# EAGLE design Orgel-form3 (EAGLE 5.11)
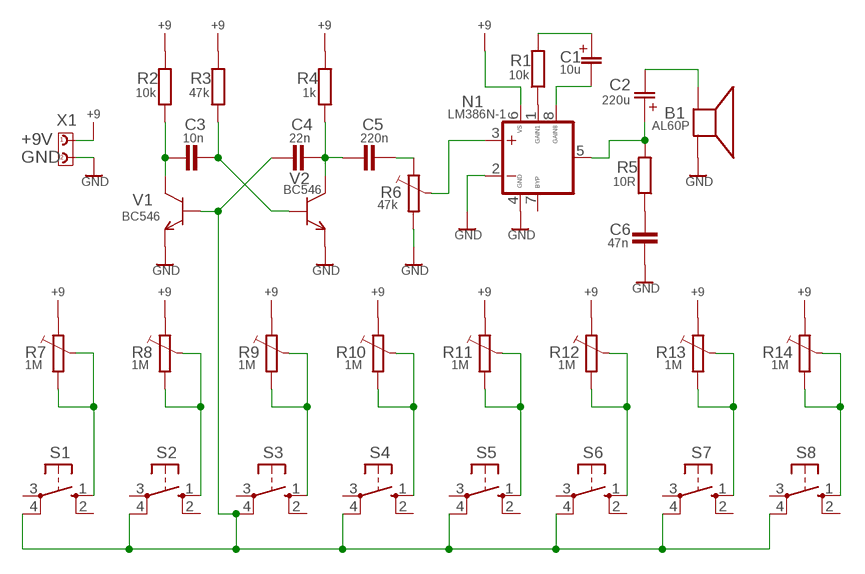
[diagram p0: schematic, sheet 1]

## Parts
B1  AL60P  [AL60P]
C1  10u  CPOL-EUE2-5  [E2-5]
C2  220u  CPOL-EUE2.5-7  [E2,5-7]
C3  10n  C-EUC05-024X044  [C050-024X044]
C4  22n  C-EUC05-024X044  [C050-024X044]
C5  220n  C-EUC05-024X044  [C050-024X044]
C6  47n  C-EUC05-024X044  [C050-024X044]
N1  LM386N-1  [DIL08]
R1  10k  R-EU_0207/10  [0207/10]
R2  10k  R-EU_0207/10  [0207/10]
R3  47k  R-EU_0207/10  [0207/10]
R4  1k  R-EU_0207/10  [0207/10]
R5  10R  R-EU_0207/10  [0207/10]
R6  47k  PT6LIEG  [PT-6]
R7  1M  PT6LIEG  [PT-6]
R8  1M  PT6LIEG  [PT-6]
R9  1M  PT6LIEG  [PT-6]
R10  1M  PT6LIEG  [PT-6]
R11  1M  PT6LIEG  [PT-6]
R12  1M  PT6LIEG  [PT-6]
R13  1M  PT6LIEG  [PT-6]
R14  1M  PT6LIEG  [PT-6]
S1  TASTE10-XX  [B3F-10XX]
S2  TASTE10-XX  [B3F-10XX]
S3  TASTE10-XX  [B3F-10XX]
S4  TASTE10-XX  [B3F-10XX]
S5  TASTE10-XX  [B3F-10XX]
S6  TASTE10-XX  [B3F-10XX]
S7  TASTE10-XX  [B3F-10XX]
S8  TASTE10-XX  [B3F-10XX]
V1  BC546  NPN_EBCBC546  [TO92IL]
V2  BC546  NPN_EBCBC546  [TO92IL]
X1  AK500/2  [AK500/2]

## Nets
+9 [+9]: N1.6(VS) R2.2 R3.2 R4.2 R7.E R8.E R9.E R10.E R11.E R12.E R13.E R14.E X1.1
GND [gnd]: B1.2 C6.2 N1.2(-IN) N1.4(GND) R6.A V1.E V2.E X1.2
N$1: C4.1 S1.4(P1) S2.4(P1) S3.4(P1) S4.4(P1) S5.4(P1) S6.4(P1) S7.4(P1) S8.4(P1) V1.B
N$2: C3.2 R3.1 V2.B
N$3: C4.2 C5.1 R4.1 V2.C
N$4: C3.1 R2.1 V1.C
N$6: R8.A R8.S S2.1(S)
N$7: R7.A R7.S S1.1(S)
N$8: R9.A R9.S S3.1(S)
N$9: R10.A R10.S S4.1(S)
N$10: R11.A R11.S S5.1(S)
N$11: R12.A R12.S S6.1(S)
N$12: R13.A R13.S S7.1(S)
N$13: R14.A R14.S S8.1(S)
N$14: N1.1(GAIN) R1.1
N$16: N1.3(+IN) R6.S
N$17: C5.2 R6.E
N$18: C1.+ R1.2
N$19: C1.- N1.8(GAIN)
N$20: B1.1 C2.-
N$21: C2.+ N1.5(OUT) R5.2
N$22: C6.1 R5.1
Unconnected: N1.7(BYPASS) S1.2(S1) S1.3(P) S2.2(S1) S2.3(P) S3.2(S1) S3.3(P) S4.2(S1) S4.3(P) S5.2(S1) S5.3(P) S6.2(S1) S6.3(P) S7.2(S1) S7.3(P) S8.2(S1) S8.3(P)

## Notes on the sheet
- +9V
- GND

## Library data of the parts
B1 = mylib:AL60P: SPEAKER Source: Buerklin
C1 C2 = mylib:CPOL-EU: POLARIZED CAPACITOR, European symbol
C3-C6 = mylib:C-EU
N1 = mylib:LM386?-*: Low Voltage Audio Power Amplifier Source: http://cache.national.com/ds/LM/LM386.pdf
R1-R5 = mylib:R-EU_: RESISTOR, European symbol
R6-R14 = mylib:PT6
S1-S8 = mylib:TASTE10-XX: OMRON SWITCH
V1 V2 = mylib:NPN_EBC
X1 = mylib:AK500/2

## Net classes
1 gnd: width 0.61 mm
2 +9: width 0.508 mm

## Board
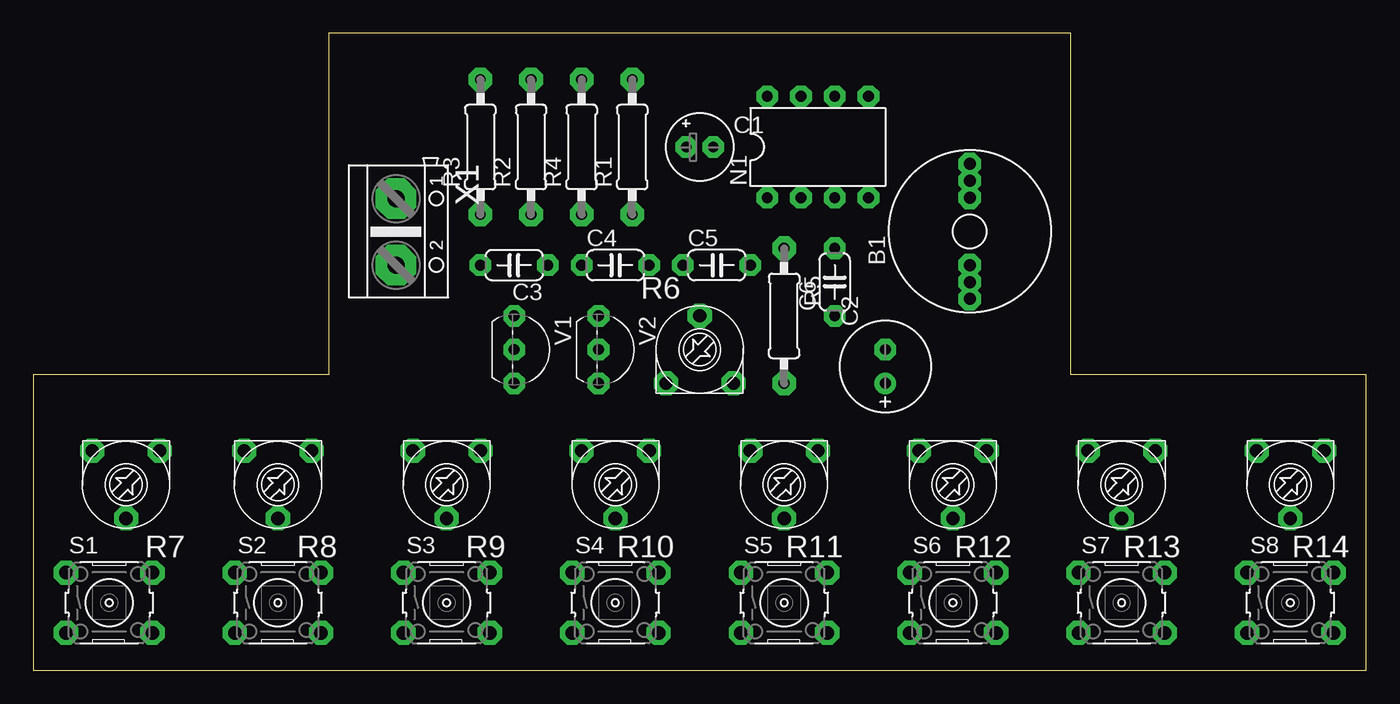
[diagram p1: board, top side]
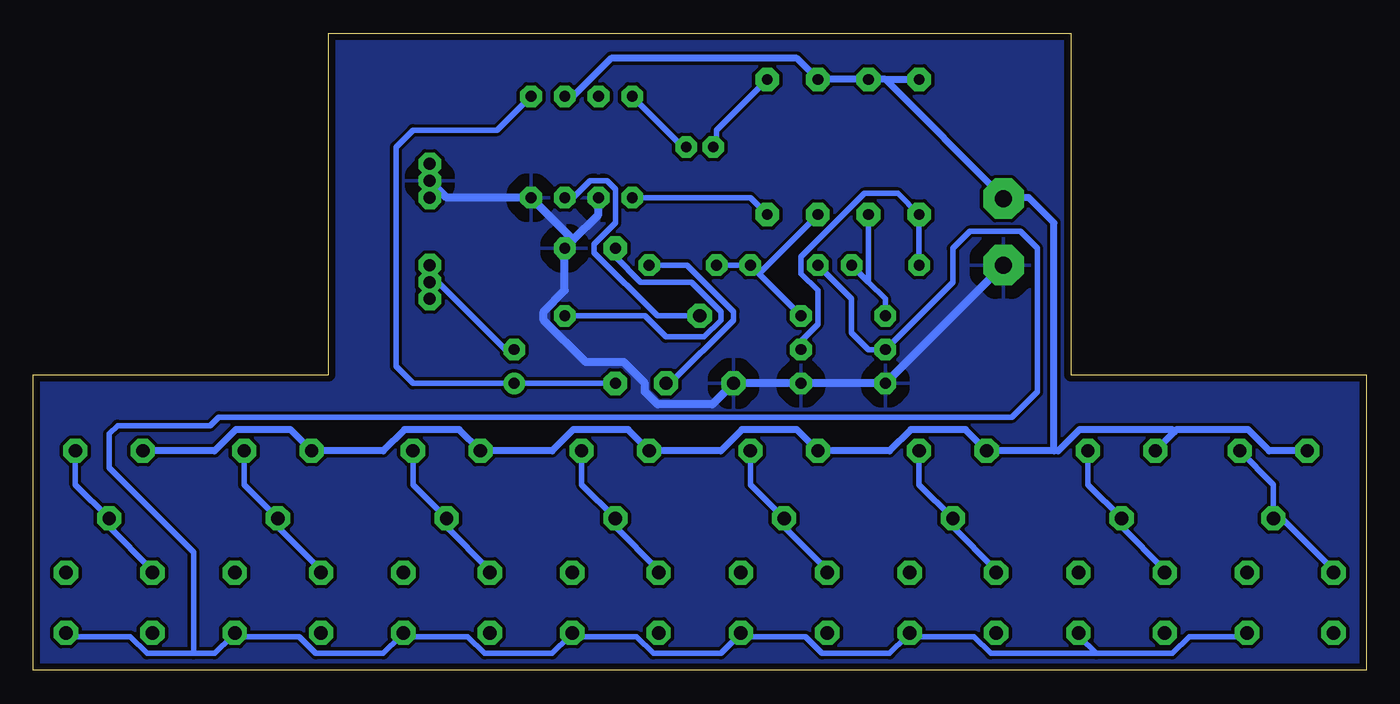
[diagram p2: board, bottom side, seen from below]

Size 100.33 x 47.93 mm. Coordinates in mm from the lower left corner, seen from the top.
Outline: 0,0 100.31,0 100.33,21.59 100.33,22.23 78.11,22.23 78.11,47.93 22.23,47.93 22.23,22.23 0,22.23 0,0
Copper layers (1+16): Top 0.035mm / dielectric 1.5mm / Bottom 0.035mm
Design rules "2HN": minimum track width 16mil, minimum drill 0.6mm, track to track 10mil, track to pad 8mil, pad to pad 8mil, via to via 8mil, smd to smd 8mil, copper to edge 20mil, drill to drill 8mil, minimum pad ring 16mil, minimum via ring 15mil, stop-mask expansion 4mil, vias tented up to drill 0mil, thermal gap 40mil

### Footprints (pad centres in the part's own frame; a part is rotated, then mirrored left to right if it is on the bottom)
AL60P = drill 0.9 pad 1.676 octagon: 1 -3.81,0; 2 3.81,0; 3 -2.54,0; 4 2.54,0; P$1 5.08,0; P$2 -5.08,0
E2-5 = drill 0.813 pad 1.27 octagon: + -1.016,0; - 1.016,0
E2,5-7 = drill 0.813 pad 1.6 round: + -1.27,0 | drill 0.813 pad 1.6 octagon: - 1.27,0
C050-024X044 = drill 0.813 octagon: 1 -2.54,0; 2 2.54,0
DIL08 = drill 0.813 pad 1.27 octagon: 1 -3.81,-3.81; 2 -1.27,-3.81; 3 1.27,-3.81; 4 3.81,-3.81; 5 3.81,3.81; 6 1.27,3.81; 7 -1.27,3.81; 8 -3.81,3.81
0207/10 = drill 0.813 pad 1.778 octagon: 1 -5.08,0; 2 5.08,0
PT-6 = drill 1 octagon: A -2.54,-2.54; E 2.54,-2.54; S 0,2.54
B3F-10XX = drill 1.016 octagon: 1 -3.251,2.261; 2 3.251,2.261; 3 -3.251,-2.261; 4 3.251,-2.261
TO92IL = drill 0.813 octagon: B 0,0; C -2.54,0; E 2.54,0
AK500/2 = drill 1.3 pad 3.048 octagon: 1 -2.464,0; 2 2.54,0

### Placement (x,y rotation side)
B1  70.48,33.02 90 top
C1  50.16,39.37 0 top
C2  64.14,22.86 90 top
C3  36.2,30.48 180 top
C4  43.81,30.48 0 top
C5  51.44,30.48 0 top
C6  60.33,29.21 90 top
N1  59.05,39.37 0 top
R1  45.09,39.37 90 top
R2  37.47,39.37 90 top
R3  33.66,39.37 90 top
R4  41.27,39.37 90 top
R5  56.52,26.67 270 top
R6  50.16,24.13 0 top
R7  6.99,13.97 180 top
R8  18.41,13.97 180 top
R9  31.11,13.97 180 top
R10  43.81,13.97 180 top
R11  56.52,13.97 180 top
R12  69.22,13.97 180 top
R13  81.92,13.97 180 top
R14  94.61,13.97 180 top
S1  5.71,5.08 0 top
S2  18.41,5.08 0 top
S3  31.11,5.08 0 top
S4  43.81,5.08 0 top
S5  56.52,5.08 0 top
S6  69.22,5.08 0 top
S7  81.92,5.08 0 top
S8  94.61,5.08 0 top
V1  36.2,24.13 270 top
V2  42.55,24.13 270 top
X1  27.3,33.02 270 top

### Tracks (layer width: path | path; a pad name or v marks a point on that pad's centre or on a via)
+9
  Bottom 0.508: 36.2,44.45 R2.2 R4.2 42.86,46.04 56.83,46.04 59.69,43.18 N1.6 | 36.2,44.45 R3.2 | 36.2,44.45 27.3,35.56 X1.1 27.3,35.24 26.99,35.56 25.4,35.56 23.5,33.66 23.5,16.51 | R7.E 7.3,16.51 8.89,18.1 14.29,18.1 14.45,17.94 | 14.45,17.94 R8.E | 23.5,16.51 23.18,16.51 21.59,18.1 14.61,18.1 14.45,17.94 | 23.5,16.51 R9.E 30.16,18.1 34.29,18.1 35.88,16.51 R10.E 42.86,18.1 46.99,18.1 48.58,16.51 R11.E 55.56,18.1 59.69,18.1 61.28,16.51 R12.E 68.26,18.1 72.39,18.1 73.98,16.51 R13.E 80.96,18.1 85.09,18.1 86.68,16.51 R14.E
GND
  Bottom 0.61: N1.2 57.78,34.29 59.69,32.38 | 59.69,32.38 C6.2 60.33,28.57 61.91,26.99 61.91,26.35 58.74,23.18 55.88,23.18 54.29,21.59 54.29,20.95 53.34,20 49.21,20 R6.A V2.E V1.E X1.2 | 59.69,32.38 N1.4 69.22,35.56 B1.2
  pour Bottom: 0,22.23 22.23,22.23 22.23,47.62 78.11,47.62 78.11,22.23 100.33,22.23 100.33,0 0,0
N$1
  Bottom 0.406: 20.32,1.27 14.61,1.27 13.34,2.54 9.21,2.54 S1.4 | 20.32,1.27 21.59,2.54 S2.4 | 20.32,1.27 28.26,1.27 29.53,2.54 34.29,2.54 S3.4 34.61,2.54 35.88,1.27 40.96,1.27 42.23,2.54 46.99,2.54 S4.4 47.31,2.54 48.58,1.27 53.66,1.27 54.93,2.54 59.69,2.54 S5.4 60.01,2.54 61.28,1.27 66.36,1.27 67.63,2.54 72.39,2.54 S6.4 72.71,2.54 73.98,1.27 79.06,1.27 80.33,2.54 85.09,2.54 S7.4 85.41,2.54 86.68,1.27 88.27,1.27 | 88.27,1.27 91.76,1.27 93.03,2.54 97.79,2.54 S8.4 | C4.1 38.73,27.94 38.73,25.4 37.47,24.13 V1.B 31.11,29.21 31.11,31.75 29.84,33.02 26.04,33.02 24.77,31.75 24.77,20.95 26.67,19.05 86.36,19.05 87,18.41 93.98,18.41 94.61,17.78 94.61,15.24 88.27,8.89 88.27,1.27
N$2
  Bottom 0.406: C3.2 R3.1 35.24,35.88 37.78,35.88 42.55,31.11 42.55,29.84 41.27,28.57 41.27,26.04 42.55,24.77 V2.B
N$3
  Bottom 0.406: 45.72,29.84 C4.2 C5.1 | V2.C 45.72,29.84 | 45.72,29.84 R4.1
N$4
  Bottom 0.406: V1.C 36.2,27.94 37.47,29.21 | 37.47,29.21 C3.1 | 37.47,29.21 R2.1
N$6
  Bottom 0.406: S2.1 15.24,7.62 18.41,10.79 R8.S 20.95,13.97 R8.A
N$7
  Bottom 0.406: 6.99,12.06 6.99,13.97 R7.A | 6.99,12.06 2.54,7.62 S1.1 | 6.99,12.06 R7.S
N$8
  Bottom 0.406: S3.1 27.94,7.62 31.11,10.79 R9.S 33.66,13.97 R9.A
N$9
  Bottom 0.406: S4.1 40.64,7.62 43.81,10.79 R10.S 46.35,13.97 R10.A
N$10
  Bottom 0.406: S5.1 53.34,7.62 56.52,10.79 R11.S 59.05,13.97 R11.A
N$11
  Bottom 0.406: S6.1 66.04,7.62 69.22,10.79 R12.S 71.75,13.97 R12.A
N$12
  Bottom 0.406: S7.1 78.74,7.62 81.92,10.79 R13.S 84.45,13.97 R13.A
N$13
  Bottom 0.406: S8.1 91.44,7.62 94.61,10.79 R14.S 97.16,13.97 R14.A
N$14
  Bottom 0.406: N1.1 46.35,35.56 R1.1
N$16
  Bottom 0.406: N1.3 59.69,35.56 58.42,36.83 57.15,36.83 56.52,36.2 56.52,33.66 58.1,32.07 58.1,31.43 53.34,26.67 R6.S
N$17
  Bottom 0.406: C5.2 51.12,30.48 47.62,26.99 47.62,26.35 52.39,21.59 R6.E
N$18
  Bottom 0.406: R1.2 48.9,40.64 48.9,39.37 C1.+
N$19
  Bottom 0.406: N1.8 51.44,39.37 C1.-
N$20
  Bottom 0.406: C2.- 64.77,24.13 69.85,29.21 B1.1
N$21
  Bottom 0.406: R5.2 C2.+ 71.75,21.59 73.03,22.86 73.03,39.37 71.75,40.64 65.41,40.64 N1.5
N$22
  Bottom 0.406: C6.1 54.29,26.67 52.7,25.08 49.85,25.08 48.58,26.35 48.58,26.99 50.8,29.21 54.61,29.21 56.52,31.11 R5.1